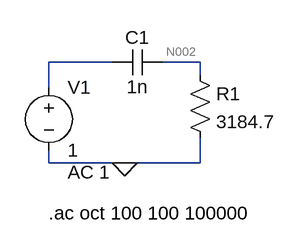
[diagram p0: schematic Draft15.asc]
Draft15.asc, the LTspice schematic file:
Version 4
SHEET 1 880 680
WIRE 48 80 -32 80
WIRE 160 80 112 80
WIRE 160 96 160 80
WIRE -32 112 -32 80
WIRE -32 208 -32 192
WIRE 64 208 -32 208
WIRE 160 208 160 176
WIRE 160 208 64 208
FLAG 64 208 0
SYMBOL res 144 80 R0
SYMATTR InstName R1
SYMATTR Value 3184.7
SYMBOL voltage -32 96 R0
WINDOW 123 24 124 Left 2
WINDOW 39 0 0 Left 2
SYMATTR InstName V1
SYMATTR Value 1
SYMATTR Value2 AC 1
SYMBOL cap 48 96 R270
WINDOW 0 32 32 VTop 2
WINDOW 3 0 32 VBottom 2
SYMATTR InstName C1
SYMATTR Value 1n
TEXT -32 272 Left 2 !.ac oct 100 100 100000

The netlist it stands for:
* Draft15.asc
R1 N002 0 3184.7
V1 N001 0 1 AC 1
C1 N001 N002 1n
.ac oct 100 100 100000
.backanno
.end

* Results of the author's LTspice run, read from the files saved beside the schematic
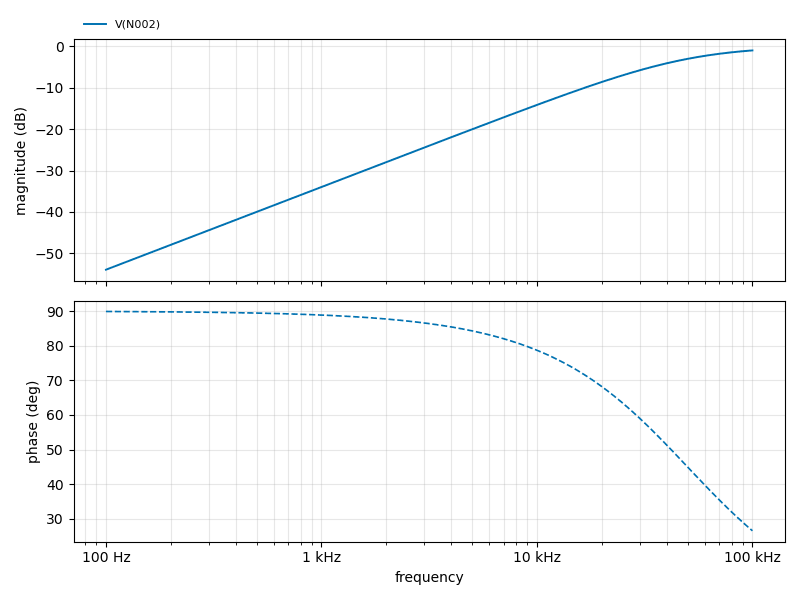
[diagram p1: AC Analysis of Draft15.asc, plotted from the saved traces]
* AC Analysis, 1 run:
*   V(N002): -53.98 dB at 100 Hz, -0.97 dB at 100 kHz, peak -0.97 dB at 100 kHz, 3 dB below the peak at 40.81 kHz